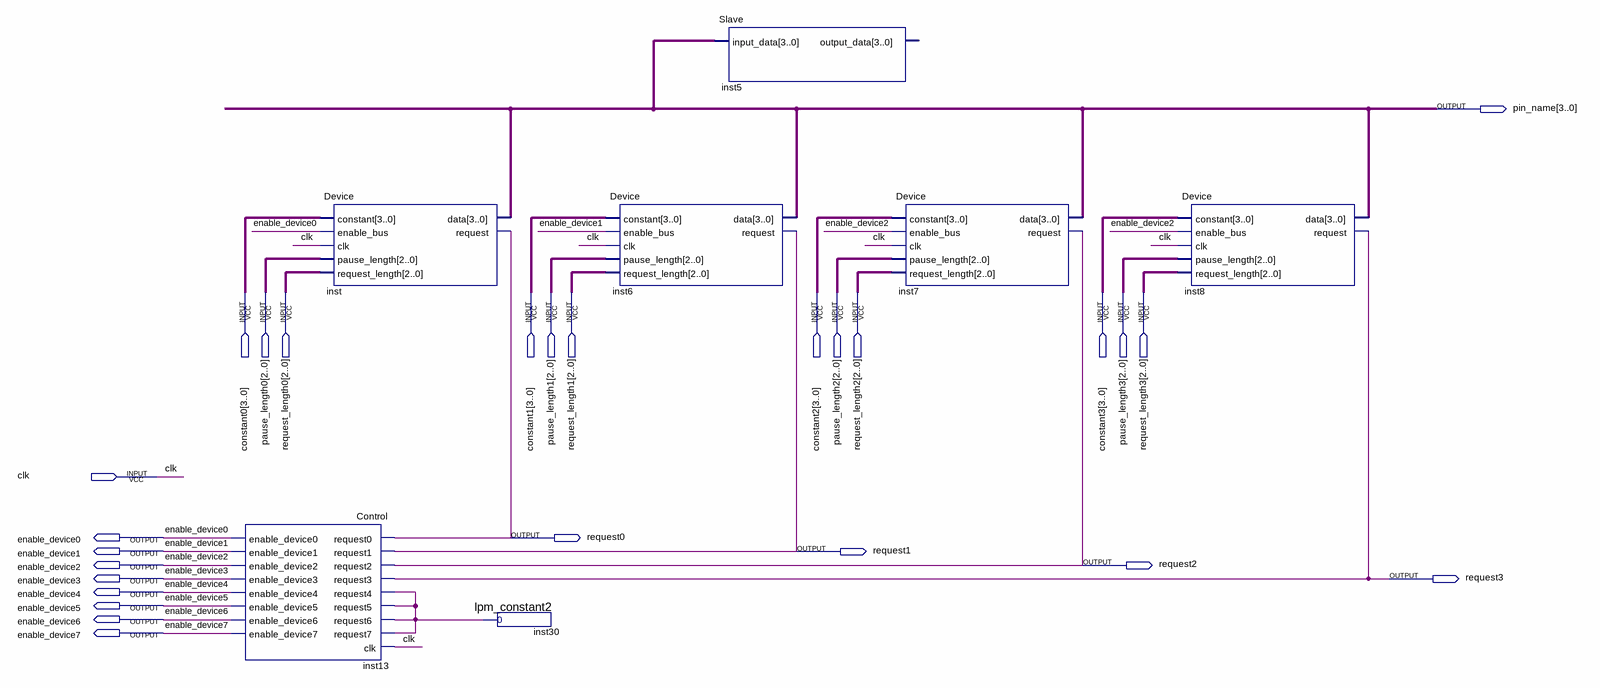
[diagram p0: schematic sheet]
// Quartus schematic LAB_5.bdf as structural Verilog: 7 symbols, 26 pins
module LAB_5 (
  input  [3:0] constant0,
  input  [2:0] pause_length0,
  input  [2:0] request_length0,
  input  [3:0] constant1,
  input  [2:0] pause_length1,
  input  [2:0] request_length1,
  input  [3:0] constant2,
  input  [2:0] pause_length2,
  input  [2:0] request_length2,
  input  [3:0] constant3,
  input  [2:0] pause_length3,
  input  [2:0] request_length3,
  input  clk,
  output [3:0] pin_name,
  output enable_device0,
  output request0,
  output enable_device1,
  output request1,
  output enable_device2,
  output request2,
  output enable_device3,
  output request3,
  output enable_device4,
  output enable_device5,
  output enable_device6,
  output enable_device7
);

  wire inst30_result;

  Control inst13 (
    .request0(request0), .request1(request1), .request2(request2), .request3(request3),
    .request4(inst30_result), .request5(inst30_result), .request6(inst30_result), .request7(inst30_result),
    .clk(clk), .enable_device0(enable_device0), .enable_device1(enable_device1),
    .enable_device2(enable_device2), .enable_device3(enable_device3), .enable_device4(enable_device4),
    .enable_device5(enable_device5), .enable_device6(enable_device6), .enable_device7(enable_device7));
  Device inst (
    .constant(constant0), .enable_bus(enable_device0), .clk(clk), .pause_length(pause_length0),
    .request_length(request_length0), .data(pin_name), .request(request0));
  lpm_constant2 inst30 (.result(inst30_result));
  Device inst6 (
    .constant(constant1), .enable_bus(enable_device1), .clk(clk), .pause_length(pause_length1),
    .request_length(request_length1), .data(pin_name), .request(request1));
  Slave inst5 (.input_data(pin_name));  // open: output_data
  Device inst7 (
    .constant(constant2), .enable_bus(enable_device2), .clk(clk), .pause_length(pause_length2),
    .request_length(request_length2), .data(pin_name), .request(request2));
  Device inst8 (
    .constant(constant3), .enable_bus(enable_device2), .clk(clk), .pause_length(pause_length3),
    .request_length(request_length3), .data(pin_name), .request(request3));
endmodule
